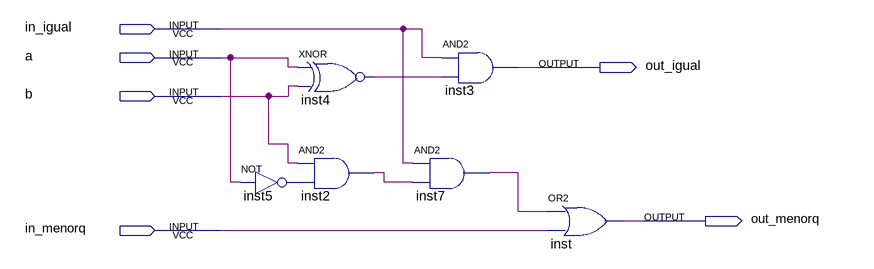
[diagram p0: schematic sheet]
// Quartus schematic menor_igualq_1bit.bdf as structural Verilog: 6 symbols, 6 pins
module menor_igualq_1bit (
  input  in_igual,
  input  a,
  input  b,
  input  in_menorq,
  output out_igual,
  output out_menorq
);

  wire inst2_out, inst4_out, inst5_out, inst7_out;

  xnor inst4 (inst4_out, a, b);
  and inst2 (inst2_out, b, inst5_out);
  not inst5 (inst5_out, a);
  and inst3 (out_igual, in_igual, inst4_out);
  and inst7 (inst7_out, in_igual, inst2_out);
  or inst (out_menorq, inst7_out, in_menorq);
endmodule
